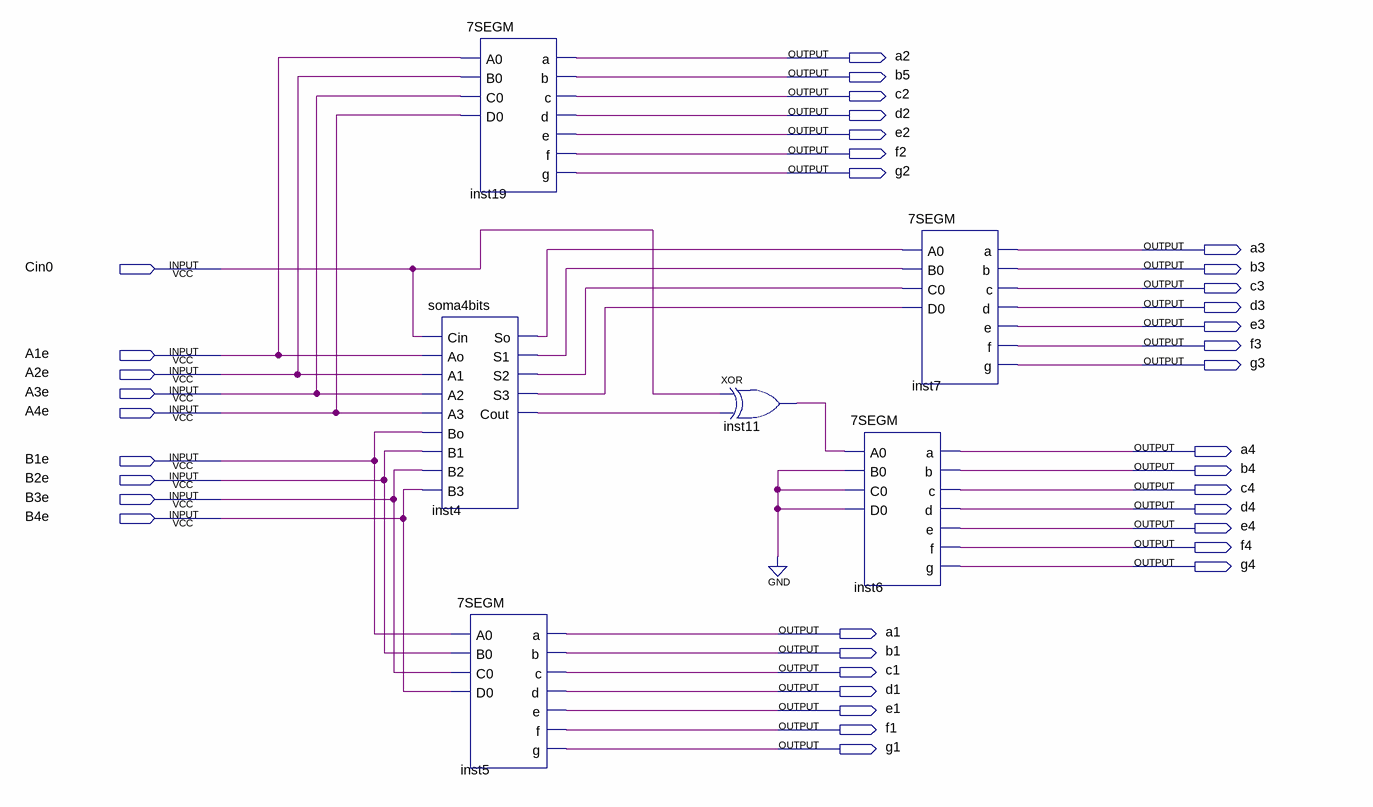
[diagram p0: schematic sheet]
// Quartus schematic HEXto7SEGM.bdf as structural Verilog: 6 symbols, 37 pins
module HEXto7SEGM (
  input  Cin0,
  input  A1e,
  input  A2e,
  input  A3e,
  input  A4e,
  input  B1e,
  input  B2e,
  input  B3e,
  input  B4e,
  output a2,
  output b5,
  output c2,
  output d2,
  output e2,
  output f2,
  output g2,
  output a3,
  output b3,
  output c3,
  output d3,
  output e3,
  output f3,
  output g3,
  output a4,
  output b4,
  output c4,
  output d4,
  output e4,
  output f4,
  output g4,
  output a1,
  output b1,
  output c1,
  output d1,
  output e1,
  output f1,
  output g1
);

  wire inst4_cout, inst4_s1, inst4_s2, inst4_s3, inst4_so, inst11_out;

  \7SEGM  inst19 (.A0(A1e), .B0(A2e), .C0(A3e), .D0(A4e), .a(a2), .b(b5), .c(c2), .d(d2), .e(e2), .f(f2), .g(g2));
  soma4bits inst4 (
    .Cin(Cin0), .Ao(A1e), .A1(A2e), .A2(A3e), .A3(A4e), .Bo(B1e), .B1(B2e), .B2(B3e), .B3(B4e),
    .So(inst4_so), .S1(inst4_s1), .S2(inst4_s2), .S3(inst4_s3), .Cout(inst4_cout));
  \7SEGM  inst5 (.A0(B1e), .B0(B2e), .C0(B3e), .D0(B4e), .a(a1), .b(b1), .c(c1), .d(d1), .e(e1), .f(f1), .g(g1));
  xor inst11 (inst11_out, Cin0, inst4_cout);
  \7SEGM  inst6 (
    .A0(inst11_out), .B0(1'b0), .C0(1'b0), .D0(1'b0), .a(a4), .b(b4), .c(c4), .d(d4), .e(e4), .f(f4), .g(g4));
  \7SEGM  inst7 (
    .A0(inst4_so), .B0(inst4_s1), .C0(inst4_s2), .D0(inst4_s3), .a(a3), .b(b3), .c(c3), .d(d3), .e(e3),
    .f(f3), .g(g3));
endmodule
